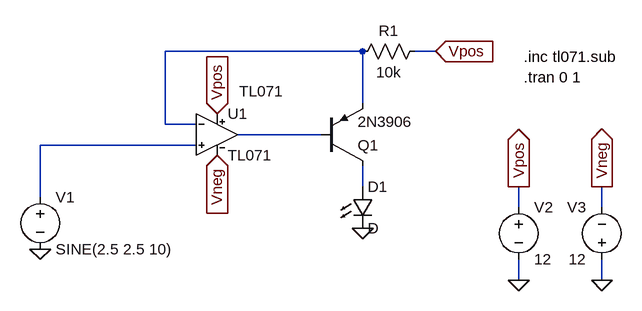
[diagram p0: schematic v2i-c.asc]
v2i-c.asc, the LTspice schematic file:
Version 4
SHEET 1 1184 680
WIRE 512 160 208 160
WIRE 624 160 592 160
WIRE 512 240 512 160
WIRE 208 272 208 160
WIRE 256 272 208 272
WIRE 448 288 320 288
WIRE 256 304 16 304
WIRE 512 368 512 336
WIRE 16 384 16 304
WIRE 752 400 752 368
WIRE 880 400 880 368
WIRE 752 512 752 480
WIRE 880 512 880 480
FLAG 752 512 0
FLAG 880 512 0
FLAG 752 368 Vpos
IOPIN 752 368 Out
FLAG 880 368 Vneg
IOPIN 880 368 Out
FLAG 288 256 Vpos
IOPIN 288 256 In
FLAG 288 320 Vneg
IOPIN 288 320 In
FLAG 16 464 0
FLAG 512 432 0
FLAG 624 160 Vpos
IOPIN 624 160 In
SYMBOL pnp 448 336 M180
SYMATTR InstName Q1
SYMATTR Value 2N3906
SYMBOL voltage 752 384 R0
SYMATTR InstName V2
SYMATTR Value 12
SYMBOL voltage 880 496 R180
WINDOW 0 24 96 Left 2
WINDOW 3 24 16 Left 2
SYMATTR InstName V3
SYMATTR Value 12
SYMBOL Voltage 16 368 R0
SYMATTR InstName V1
SYMATTR Value SINE(2.5 2.5 10)
SYMBOL TL071 288 224 R0
WINDOW 38 34 -3 Left 2
SYMATTR InstName U1
SYMBOL res 608 144 R90
WINDOW 0 0 56 VBottom 2
WINDOW 3 32 56 VTop 2
SYMATTR InstName R1
SYMATTR Value 10k
SYMBOL LED 496 368 R0
SYMATTR InstName D1
TEXT 760 200 Left 2 !.tran 0 1
TEXT 760 168 Left 2 !.inc tl071.sub

The netlist it stands for:
* v2i-c.asc
Q1 N004 N002 N001 0 2N3906
V2 Vpos 0 12
V3 0 Vneg 12
V1 N003 0 SINE(2.5 2.5 10)
XU1 N003 N001 Vpos Vneg N002 TL071 TL071  ; pins In+ In- V+ V- OUT
R1 Vpos N001 10k
D1 N004 0 D
.model D D
.lib standard.dio
.model NPN NPN
.model PNP PNP
.lib standard.bjt
.tran 0 1
.inc tl071.sub
.lib TL071.sub
.backanno
.end